# EAGLE design Hex-pendant-apa102-v1a (EAGLE 8.6.0)
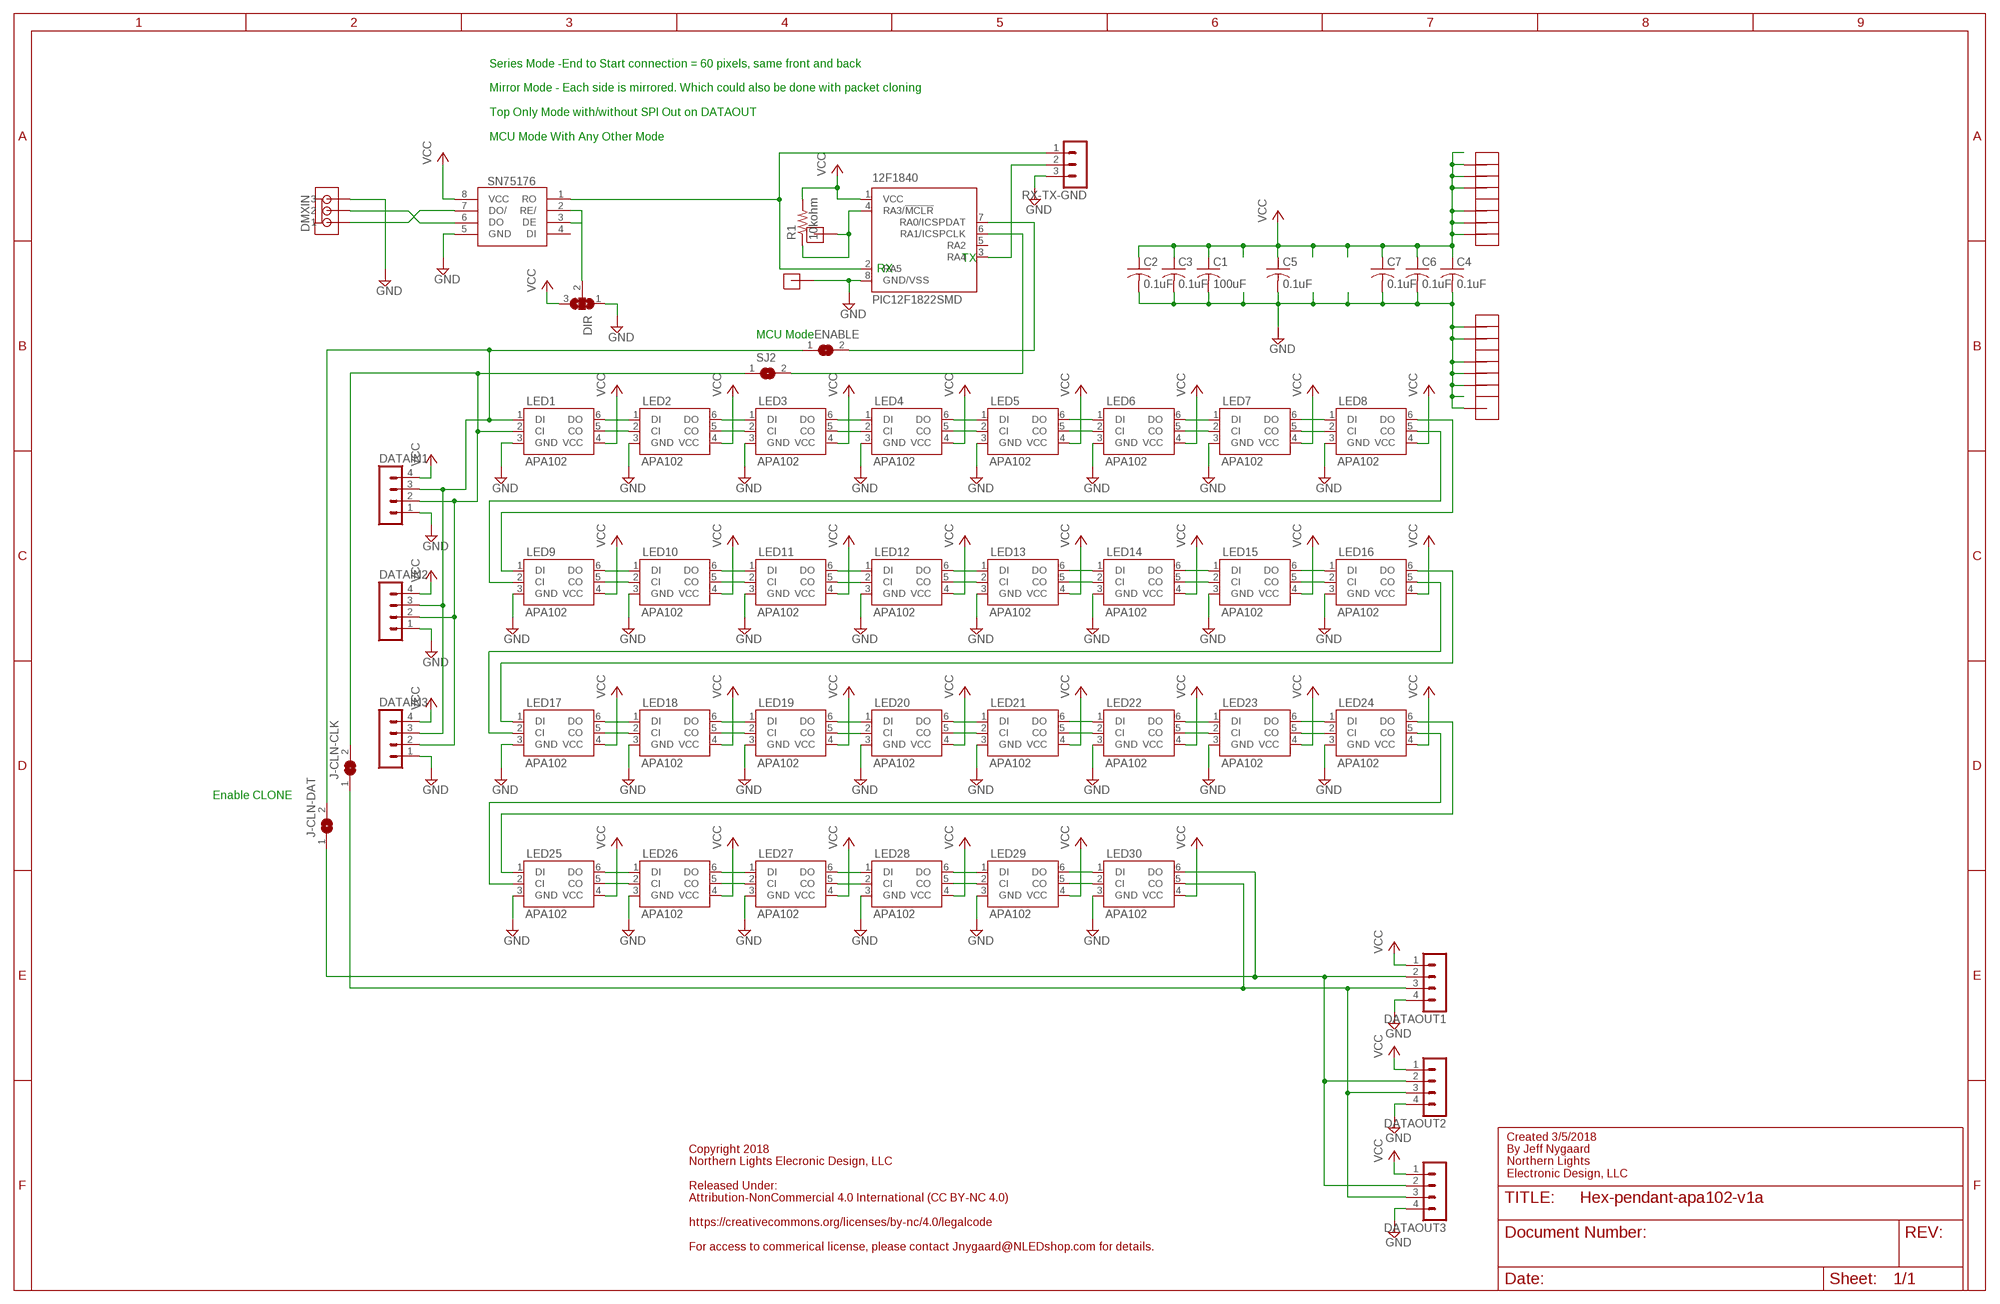
[diagram p0: schematic, sheet 1]

## Parts
12F1840  PIC12F1822SMD  [SO-08]
BUTTGND  JUMPER  [JUMPER]
BUTTON  JUMPER  [JUMPER]
C1  100uF  C-USC1206  [C1206]
C2  0.1uF  C-USC1206  [C1206]
C3  0.1uF  C-USC1206  [C1206]
C4  0.1uF  C-USC1206  [C1206]
C5  0.1uF  C-USC1206  [C1206]
C6  0.1uF  C-USC1206  [C1206]
C7  0.1uF  C-USC1206  [C1206]
DATAIN1  MA04-1  [MA04-1]
DATAIN2  MA04-1  [MA04-1]
DATAIN3  MA04-1  [MA04-1]
DATAOUT1  MA04-1  [MA04-1]
DATAOUT2  MA04-1  [MA04-1]
DATAOUT3  MA04-1  [MA04-1]
DIR  SJ2W  [SJ_2]
DMXIN  MOLEXKK3  [MOLEXKK3]
ENABLE  SJ  [SJ]
J-CLN-CLK  SJ  [SJ]
J-CLN-DAT  SJ  [SJ]
JGND1  1HEADER  [J1]
JGND3  1HEADER  [J1]
JGND4  1HEADER  [J1]
JGND5  1HEADER  [J1]
JGND6  1HEADER  [J1]
JGND7  1HEADER  [J1]
JVCC1  1HEADER  [J1]
JVCC2  1HEADER  [J1]
JVCC3  1HEADER  [J1]
JVCC4  1HEADER  [J1]
JVCC5  1HEADER  [J1]
JVCC6  1HEADER  [J1]
LED1  APA102  [APA102]
LED2  APA102  [APA102]
LED3  APA102  [APA102]
LED4  APA102  [APA102]
LED5  APA102  [APA102]
LED6  APA102  [APA102]
LED7  APA102  [APA102]
LED8  APA102  [APA102]
LED9  APA102  [APA102]
LED10  APA102  [APA102]
LED11  APA102  [APA102]
LED12  APA102  [APA102]
LED13  APA102  [APA102]
LED14  APA102  [APA102]
LED15  APA102  [APA102]
LED16  APA102  [APA102]
LED17  APA102  [APA102]
LED18  APA102  [APA102]
LED19  APA102  [APA102]
LED20  APA102  [APA102]
LED21  APA102  [APA102]
LED22  APA102  [APA102]
LED23  APA102  [APA102]
LED24  APA102  [APA102]
LED25  APA102  [APA102]
LED26  APA102  [APA102]
LED27  APA102  [APA102]
LED28  APA102  [APA102]
LED29  APA102  [APA102]
LED30  APA102  [APA102]
R1  10kohm  R-US_R1206  [R1206]
RX-TX-GND  MA03-12  [MA03-1-V2]
SJ2  SJ  [SJ]
TRANSCEIVER  SN75176SMD  [SOIC-8]

## Nets
GND: 12F1840.8(GND/VSS) BUTTGND.2(J1) C1.2 C2.2 C3.2 C4.2 C5.2 C6.2 C7.2 DATAIN1.1 DATAIN2.1 DATAIN3.1 DATAOUT1.4 DATAOUT2.4 DATAOUT3.4 DIR.1 DMXIN.3 JGND1.2(J1) JGND3.2(J1) JGND4.2(J1) JGND6.2(J1) JGND7.2(J1) JVCC4.2(J1) LED1.3(GND) LED2.3(GND) LED3.3(GND) LED4.3(GND) LED5.3(GND) LED6.3(GND) LED7.3(GND) LED8.3(GND) LED9.3(GND) LED10.3(GND) LED11.3(GND) LED12.3(GND) LED13.3(GND) LED14.3(GND) LED15.3(GND) LED16.3(GND) LED17.3(GND) LED18.3(GND) LED19.3(GND) LED20.3(GND) LED21.3(GND) LED22.3(GND) LED23.3(GND) LED24.3(GND) LED25.3(GND) LED26.3(GND) LED27.3(GND) LED28.3(GND) LED29.3(GND) LED30.3(GND) RX-TX-GND.3 TRANSCEIVER.5(GND)
N$1: LED1.6(DO) LED2.1(DI)
N$2: LED2.6(DO) LED3.1(DI)
N$3: LED3.6(DO) LED4.1(DI)
N$4: LED3.5(CO) LED4.2(CI)
N$5: LED2.5(CO) LED3.2(CI)
N$6: LED1.5(CO) LED2.2(CI)
N$7: LED4.6(DO) LED5.1(DI)
N$8: LED4.5(CO) LED5.2(CI)
N$9: LED5.6(DO) LED6.1(DI)
N$10: LED5.5(CO) LED6.2(CI)
N$11: LED8.5(CO) LED9.2(CI)
N$12: LED8.6(DO) LED9.1(DI)
N$13: LED7.6(DO) LED8.1(DI)
N$14: LED7.5(CO) LED8.2(CI)
N$15: LED6.5(CO) LED7.2(CI)
N$16: LED6.6(DO) LED7.1(DI)
N$17: LED17.6(DO) LED18.1(DI)
N$18: LED18.6(DO) LED19.1(DI)
N$19: LED19.6(DO) LED20.1(DI)
N$20: LED19.5(CO) LED20.2(CI)
N$21: LED18.5(CO) LED19.2(CI)
N$22: LED9.6(DO) LED10.1(DI)
N$23: LED10.6(DO) LED11.1(DI)
N$24: LED11.6(DO) LED12.1(DI)
N$25: LED11.5(CO) LED12.2(CI)
N$26: LED10.5(CO) LED11.2(CI)
N$27: LED9.5(CO) LED10.2(CI)
N$28: LED12.6(DO) LED13.1(DI)
N$29: LED12.5(CO) LED13.2(CI)
N$30: LED13.6(DO) LED14.1(DI)
N$31: LED13.5(CO) LED14.2(CI)
N$32: LED14.6(DO) LED15.1(DI)
N$33: LED14.5(CO) LED15.2(CI)
N$34: LED15.6(DO) LED16.1(DI)
N$35: LED15.5(CO) LED16.2(CI)
N$36: LED17.5(CO) LED18.2(CI)
N$37: LED20.6(DO) LED21.1(DI)
N$38: LED20.5(CO) LED21.2(CI)
N$39: LED21.6(DO) LED22.1(DI)
N$40: LED21.5(CO) LED22.2(CI)
N$41: LED25.6(DO) LED26.1(DI)
N$42: LED26.6(DO) LED27.1(DI)
N$43: LED27.6(DO) LED28.1(DI)
N$44: LED27.5(CO) LED28.2(CI)
N$45: LED26.5(CO) LED27.2(CI)
N$46: LED25.5(CO) LED26.2(CI)
N$47: LED28.6(DO) LED29.1(DI)
N$48: LED28.5(CO) LED29.2(CI)
N$49: LED29.6(DO) LED30.1(DI)
N$50: LED29.5(CO) LED30.2(CI)
N$55: LED24.5(CO) LED25.2(CI)
N$56: LED24.6(DO) LED25.1(DI)
N$57: LED23.6(DO) LED24.1(DI)
N$58: LED23.5(CO) LED24.2(CI)
N$59: LED22.5(CO) LED23.2(CI)
N$60: LED22.6(DO) LED23.1(DI)
N$61: LED16.5(CO) LED17.2(CI)
N$62: LED16.6(DO) LED17.1(DI)
N$65: DATAIN1.3 DATAIN2.3 DATAIN3.3 ENABLE.1 J-CLN-DAT.2 LED1.1(DI)
N$66: DATAIN1.2 DATAIN2.2 DATAIN3.2 J-CLN-CLK.2 LED1.2(CI) SJ2.1
N$117: DATAOUT1.3 DATAOUT2.3 DATAOUT3.3 J-CLN-CLK.1 LED30.5(CO)
N$121: DATAOUT1.2 DATAOUT2.2 DATAOUT3.2 J-CLN-DAT.1 LED30.6(DO)
N$126: 12F1840.2(RA5) RX-TX-GND.1 TRANSCEIVER.1(RO)
N$127: DIR.2 TRANSCEIVER.2(RE/) TRANSCEIVER.3(DE)
N$128: 12F1840.4(RA3/!MCLR) BUTTON.2(J1) R1.1
N$129: DMXIN.2 TRANSCEIVER.6(DO)
N$130: 12F1840.3(RA4) RX-TX-GND.2
N$131: DMXIN.1 TRANSCEIVER.7(DO/)
N$132: 12F1840.7(RA0/ICSPDAT) ENABLE.2
N$133: 12F1840.6(RA1/ICSPCLK) SJ2.2
VCC: 12F1840.1(VCC) C1.1 C2.1 C3.1 C4.1 C5.1 C6.1 C7.1 DATAIN1.4 DATAIN2.4 DATAIN3.4 DATAOUT1.1 DATAOUT2.1 DATAOUT3.1 DIR.3 JGND5.2(J1) JVCC1.2(J1) JVCC2.2(J1) JVCC3.2(J1) JVCC5.2(J1) JVCC6.2(J1) LED1.4(VCC) LED2.4(VCC) LED3.4(VCC) LED4.4(VCC) LED5.4(VCC) LED6.4(VCC) LED7.4(VCC) LED8.4(VCC) LED9.4(VCC) LED10.4(VCC) LED11.4(VCC) LED12.4(VCC) LED13.4(VCC) LED14.4(VCC) LED15.4(VCC) LED16.4(VCC) LED17.4(VCC) LED18.4(VCC) LED19.4(VCC) LED20.4(VCC) LED21.4(VCC) LED22.4(VCC) LED23.4(VCC) LED24.4(VCC) LED25.4(VCC) LED26.4(VCC) LED27.4(VCC) LED28.4(VCC) LED29.4(VCC) LED30.4(VCC) R1.2 TRANSCEIVER.8(VCC)
Unconnected: 12F1840.5(RA2) TRANSCEIVER.4(DI)

## Notes on the sheet
- Series Mode -End to Start connection = 60 pixels, same front and back
  
  Mirror Mode - Each side is mirrored. Which could also be done with packet cloning
  
  Top Only Mode with/without SPI Out on DATAOUT
  
  MCU Mode With Any Other Mode
- TX
- RX
- MCU Mode
- Enable CLONE
- Created 3/5/2018
  By Jeff Nygaard
  Northern Lights
  Electronic Design, LLC
- Copyright 2018
  Northern Lights Elecronic Design, LLC
  
  Released Under:
  Attribution-NonCommercial 4.0 International (CC BY-NC 4.0)
  
  https://creativecommons.org/licenses/by-nc/4.0/legalcode
  
  For access to commerical license, please contact Jnygaard@NLEDshop.com for details.

## Library data of the parts
12F1840 = ChromationSystems-2:PIC12F1822: 8-Pin FLASH-Based 8-Bit CMOS Microcontroller Precision Internal 4 MHz oscillator factory calibrated to ±1% Low Power Features: Standby Current: - 1 nA @ 2.0V, typical Operating Current: - 8.5µA @ 32 kHz, 2.0V, typical - 100µA @ 1 MHz, 2.0V, typical Watchdog Timer Current: - 300 nA @ 2.0V, typical Timer1 oscillator current: - 4µA @ 32 kHz, 2.0V, typical Analog-to-Digital Converter module: - 10-bit resolution - Programmable 4-channel input - Voltage reference input Source: http://www.microchip.com .. 41190E.pdf; MF: MICROCHIP; MPN: PIC12F675-E/SN; OC_FARNELL: 9759026; OC_NEWARK: 92C4341
BUTTGND BUTTON = ChromationSystems-1:JUMPER
C1-C7 = rcl:C-US: CAPACITOR, American symbol
DATAIN1-DATAIN3 DATAOUT1-DATAOUT3 = ChromationSystems-2:MA04-1: PIN HEADER; OC_FARNELL: unknown; OC_NEWARK: unknown
DIR = jumper:SJ2W: SMD solder JUMPER
DMXIN = ChromationSystems-1:MOLEXKK3
ENABLE J-CLN-CLK J-CLN-DAT SJ2 = jumper:SJ: SMD solder JUMPER
JGND1 JGND3-JGND7 JVCC1-JVCC6 = ChromationSystems-1:1HEADER
LED1-LED30 = ChromationSystems-2:APA102
R1 = rcl:R-US_: RESISTOR, American symbol
RX-TX-GND = ChromationSystems-2:MA03-1: PIN HEADER
TRANSCEIVER = ChromationSystems-2:SN75176

## Board
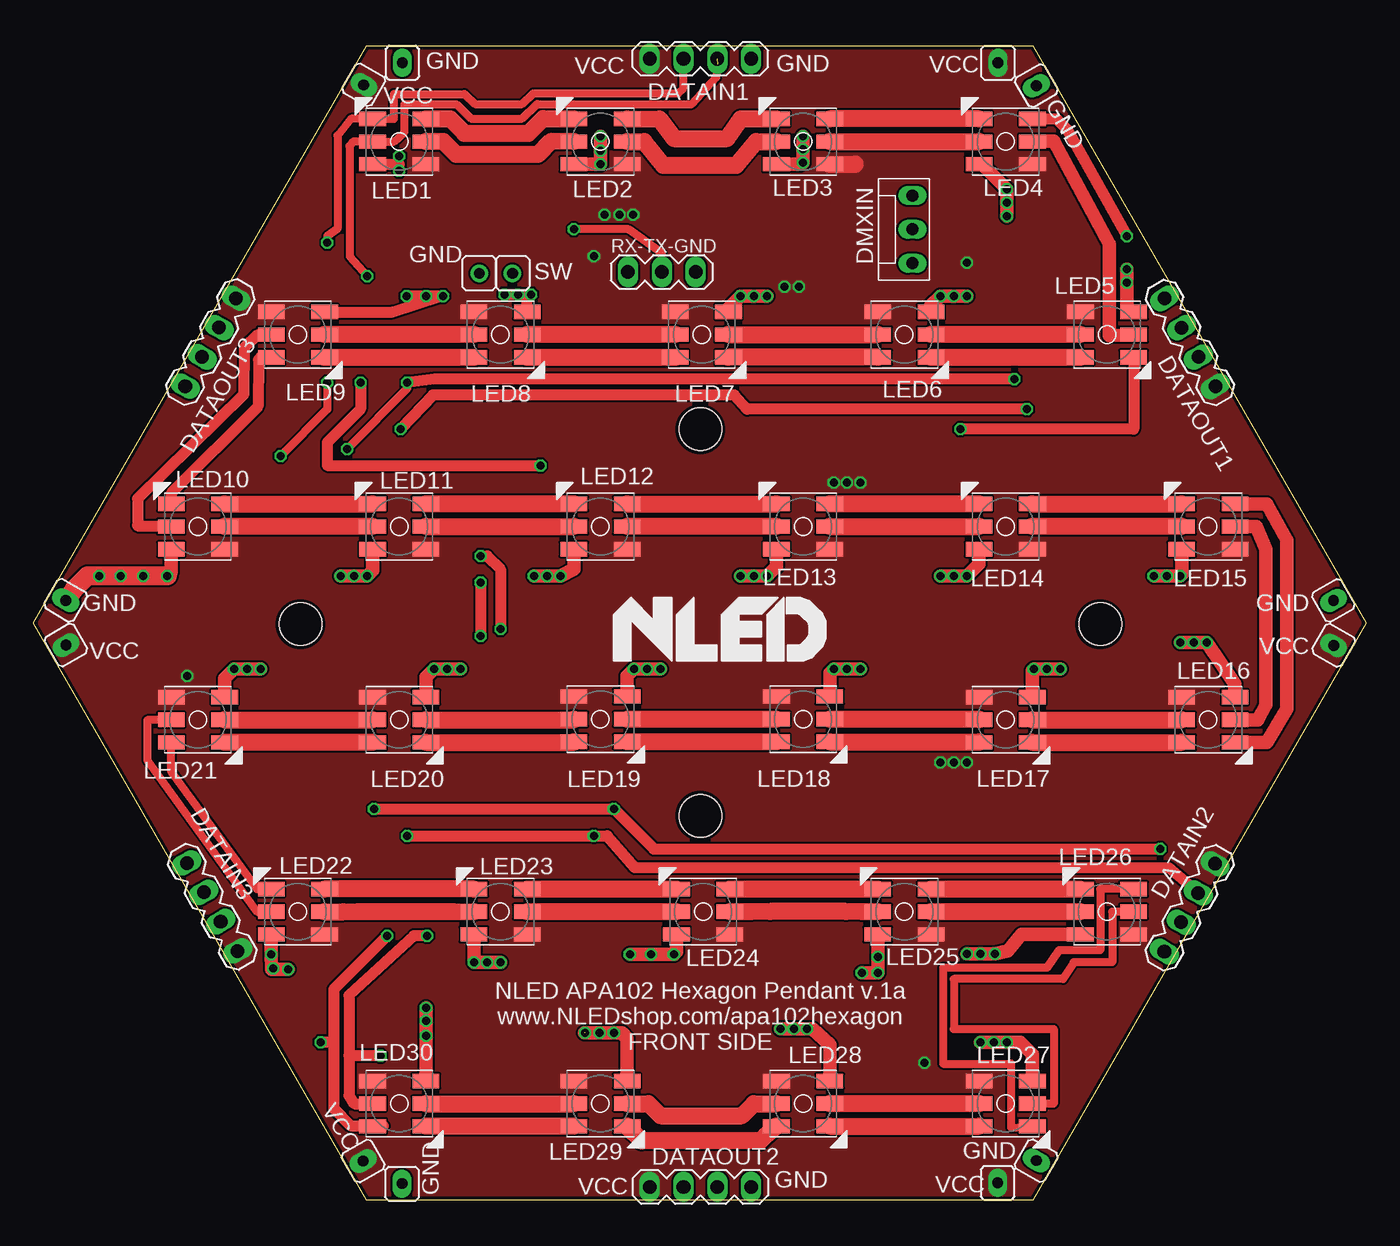
[diagram p1: board, top side]
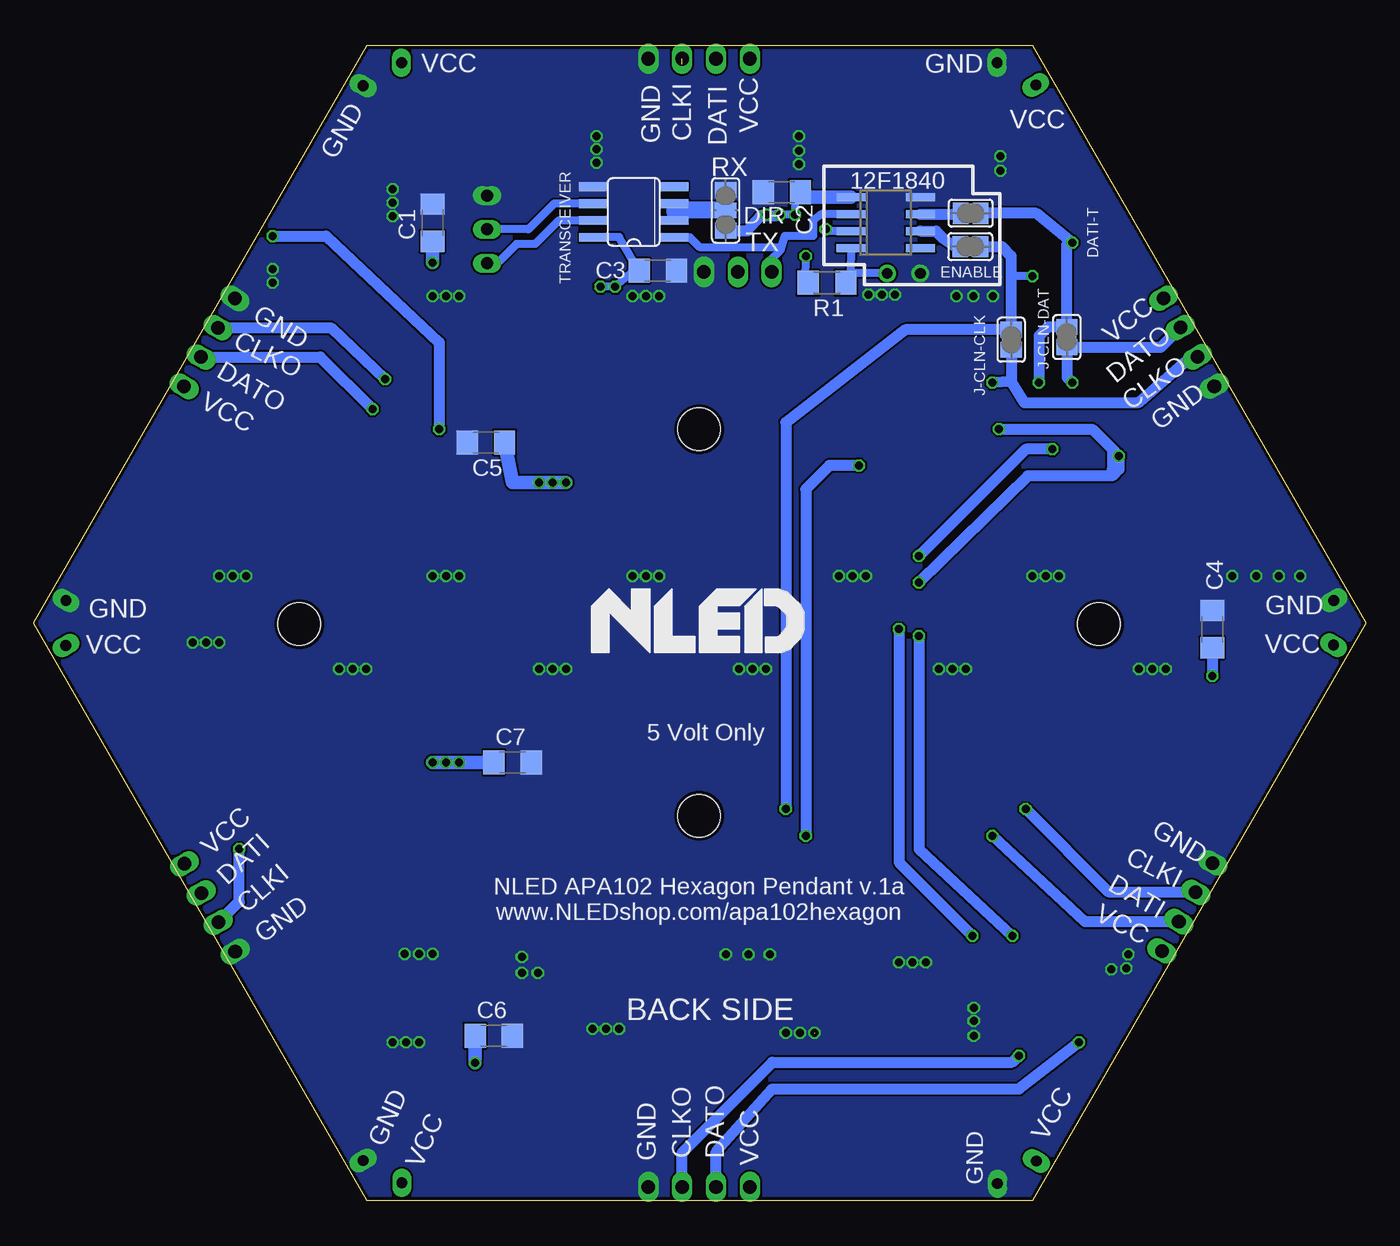
[diagram p2: board, bottom side, seen from below]

Size 100 x 86.6 mm. Coordinates in mm from the lower left corner, seen from the top.
Outline: 25,0 0,43.3 25,86.6 75,86.6 100,43.3 75,0 25,0
Copper layers (1*16): Top 0.035mm / dielectric 1.5mm / Bottom 0.035mm
Design rules "SeeedStudio_2layer_DRU_no_angle_20140221 *": minimum track width 6mil, minimum drill 12mil, track to track 6mil, track to pad 6mil, pad to pad 6mil, via to via 6mil, smd to smd 0mil, copper to edge 10mil, drill to drill 10mil, minimum pad ring 10mil, minimum via ring 6mil, stop-mask expansion 2mil, vias tented up to drill 100mil, thermal gap 10mil
Holes 3.2 mm at 50.05,57.84 20.05,43.22 80.05,43.22 50.05,28.84

### Footprints (pad centres in the part's own frame; a part is rotated, then mirrored left to right if it is on the bottom)
SO-08 = smd 0.6 x 2.2: 1 -1.905,-2.6; 2 -0.635,-2.6; 3 0.635,-2.6; 4 1.905,-2.6; 5 1.905,2.6; 6 0.635,2.6; 7 -0.635,2.6; 8 -1.905,2.6
JUMPER = drill 0.8: 2 0,0
C1206 = smd 1.6 x 1.8: 1 -1.4,0; 2 1.4,0
MA04-1 = drill 1.016 long: 1 -3.81,0; 2 -1.27,0; 3 1.27,0; 4 3.81,0
SJ_2 = smd 1.168 x 1.6: 1 -1.524,0; 2 0,0; 3 1.524,0
MOLEXKK3 = drill 0.9 long: 1 -2.54,0 | drill 0.9 pad 1.422 long: 2 0,0; 3 2.54,0
SJ = smd 1.168 x 1.6: 1 -0.762,0; 2 0.762,0
J1 = drill 0.813 pad 1.422 long: 2 0,0
APA102 = smd 2 x 1.067: 1 -2,1.7; 2 -2,0; 3 -2,-1.7; 4 2,-1.7; 5 2,0; 6 2,1.7
R1206 = smd 1.6 x 1.803: 1 -1.422,0; 2 1.422,0
MA03-1-V2 = drill 1.016 long: 1 -2.54,0; 2 0,0; 3 2.54,0
SOIC-8 = smd 0.66 x 2.032: 1 -1.905,-3.073; 2 -0.635,-3.073; 3 0.635,-3.073; 4 1.905,-3.073; 5 1.905,3.073; 6 0.635,3.073; 7 -0.635,3.073; 8 -1.905,3.073

### Placement (x,y rotation side)
12F1840  36.05,73.34 270 bottom
BUTTGND  33.45,69.54 0 top
BUTTON  35.95,69.54 0 top
C1  70.05,73.33 90 bottom
C2  43.85,75.64 180 bottom
C3  53.15,69.74 0 bottom
C4  11.55,42.84 90 bottom
C5  66.05,56.84 180 bottom
C6  65.45,12.34 0 bottom
C7  64.05,32.84 0 bottom
DATAIN1  50.05,85.64 180 top
DATAIN2  86.76,21.94 60 top
DATAIN3  13.42,21.99 300 top
DATAOUT1  86.78,64.36 120 top
DATAOUT2  50.05,0.99 0 top
DATAOUT3  13.3,64.37 240 top
DIR  48.06,74.26 270 bottom
DMXIN  65.95,72.84 90 top
ENABLE  29.68,74.04 180 bottom
J-CLN-CLK  26.63,64.55 90 bottom
J-CLN-DAT  22.46,64.75 90 bottom
JGND1  27.69,85.35 90 top
JGND3  75.25,2.97 330 top
JGND4  27.66,1.24 90 top
JGND5  24.75,2.93 30 top
JGND6  2.43,45 150 top
JGND7  97.55,44.98 30 top
JVCC1  97.56,41.62 150 top
JVCC2  24.79,83.67 150 top
JVCC3  2.45,41.64 30 top
JVCC4  75.26,83.61 30 top
JVCC5  72.35,1.29 90 top
JVCC6  72.38,85.33 90 top
LED1  27.45,79.42 0 top
LED2  42.55,79.42 0 top
LED3  57.75,79.42 0 top
LED4  72.95,79.42 0 top
LED5  80.55,64.94 180 top
LED6  65.35,64.94 180 top
LED7  50.15,64.94 180 top
LED8  35.05,64.94 180 top
LED9  19.85,64.94 180 top
LED10  12.35,50.54 0 top
LED11  27.45,50.54 0 top
LED12  42.55,50.54 0 top
LED13  57.75,50.54 0 top
LED14  72.95,50.54 0 top
LED15  88.15,50.54 0 top
LED16  88.15,36.04 180 top
LED17  72.95,36.04 180 top
LED18  57.75,36.09 180 top
LED19  42.55,36.09 180 top
LED20  27.45,36.04 180 top
LED21  12.35,36.04 180 top
LED22  19.85,21.64 0 top
LED23  35.05,21.64 0 top
LED24  50.25,21.64 0 top
LED25  65.35,21.64 0 top
LED26  80.55,21.64 0 top
LED27  72.95,7.24 180 top
LED28  57.75,7.24 180 top
LED29  42.55,7.24 180 top
LED30  27.45,7.24 180 top
R1  40.45,68.84 180 bottom
RX-TX-GND  47.15,69.64 0 top
SJ2  29.7,71.54 180 bottom
TRANSCEIVER  54.95,74.14 90 bottom

### Tracks (layer width: path | path; a pad name or v marks a point on that pad's centre or on a via)
GND  (via drill 0.6)  (1 unrouted)
  Top 0.61: v27.45,78.34 27.45,77.72 v27.45,77.24 | LED7.3 52.15,66.94
  Top 0.813: LED9.3 26.97,66.64 30.5,67.78 v30.76,67.84 v28,67.84 | LED8.3 37.05,67.84 v37.35,67.94 v35.35,67.94 | LED1.3 27.45,77.72
  Top 1.016: LED30.3 v29.45,14.44 | LED29.3 44.55,12.14 44.15,12.54 41.37,12.54 | LED28.3 59.75,11.64 58.45,12.84 v56.05,12.84 | LED22.3 v17.85,18.43 v17.86,18.43 17.89,17.3 v19.13,17.33 | LED2.3 42.53,77.72 v42.55,77.74 v42.55,78.74 v42.55,79.84 | LED3.3 57.53,77.72 v57.75,77.84 v57.75,78.84 v57.75,79.84 | LED4.3 71.17,77.72 v73.05,75.84 v73.05,74.84 v73.05,73.84 | LED6.3 67.35,67.14 v68.05,67.84 v69.05,67.84 v70.05,67.84 | LED11.3 25.45,47.24 v25.05,46.84 v24.05,46.84 v23.05,46.84 | LED10.3 10.35,47.14 v10.05,46.84 | LED12.3 40.55,47.34 v39.55,46.84 v38.55,46.84 v37.55,46.84 | LED13.3 55.75,47.54 v55.05,46.84 v54.05,46.84 v53.05,46.84 | LED14.3 70.95,47.74 v70.05,46.84 v69.05,46.84 v68.05,46.84 | LED15.3 86.15,46.94 v86.05,46.84 v85.05,46.84 v84.05,46.84 | LED20.3 29.45,39.24 v30.05,39.84 v31.05,39.84 v32.05,39.84 | LED19.3 44.55,39.34 v45.05,39.84 v46.05,39.84 v47.05,39.84 | LED18.3 59.75,39.54 v60.05,39.84 v61.05,39.84 v62.05,39.84 | LED17.3 74.95,39.74 v75.05,39.84 v76.05,39.84 v77.05,39.84 | LED16.3 90.15,38.74 v88.05,41.84 v87.05,41.84 v86.05,41.84 | LED23.3 v33.05,17.84 v34.05,17.84 v35.05,17.84 | LED24.3 48.25,18.64 v48.05,18.44 v46.35,18.44 v44.75,18.44 | LED25.3 v63.35,18.24 v63.35,17.04 v62.15,17.04 | LED26.3 74.15,19.94 73.1,18.69 v72.15,18.49 v71.05,18.49 v70.05,18.49 | LED27.3 74.95,10.94 74.05,11.84 v73.05,11.84 v72.05,11.84 v71.05,11.84 | LED21.3 14.35,39.14 v15.05,39.84 v16.05,39.84 v17.05,39.84 | 52.15,66.94 v53.05,67.84 v54.05,67.84 v55.05,67.84 | LED5.3 82.05,66.64 v82.05,69.84
  Top 1.422: v10.05,46.84 v8.25,46.84 v6.55,46.84 4.05,46.84 3.05,45.84 JGND6.2
  other vias: 29.45,13.44 29.45,12.34 43.55,12.54 57.05,12.84 58.05,12.84 36.35,67.94 29.46,67.84 18,17.4 82.05,68.84 4.95,46.84 42.48,12.54 41.39,12.55
  pour Bottom (no thermals): 25.05,-0.16 0.05,43.84 25.05,86.84 75.05,86.84 100.05,43.84 75.05,-0.16
N$1
  Top 1.27: LED1.6 31.27,81.12 32.35,80.04 37.15,80.04 38.25,81.14 LED2.1
N$2
  Top 1.27: LED2.6 46.98,81.11 48.05,79.64 52.05,79.64 53.09,81.12 LED3.1
N$3
  Top 1.27: LED4.1 LED3.6
N$4
  Top 1.27: LED3.5 LED4.2
N$5
  Top 1.27: LED2.5 45.83,79.42 47.25,77.64 52.75,77.64 54.23,79.42 LED3.2
N$6
  Top 1.27: LED2.2 38.85,79.44 37.85,78.44 31.75,78.44 30.77,79.42 LED1.5
N$7  (via drill 0.6)
  Top 0.813: LED4.6 76.77,81.12 77.55,80.34 v82.05,72.34 | LED5.1 82.55,57.84 v69.55,57.84
  Bottom 0.813: v82.05,72.34 78.05,72.34 69.55,64.34 v69.55,57.84
N$8
  Top 1.016: LED4.5 74.97,79.44 76.55,79.44 80.73,71.74 80.73,64.87 LED5.2
N$9
  Top 1.27: LED6.1 LED5.6
N$10
  Top 1.27: LED5.5 LED6.2
N$11
  Top 1.27: LED8.5 LED9.2
N$12
  Top 1.27: LED9.1 LED8.6
N$13
  Top 1.27: LED8.1 LED7.6
N$14
  Top 1.27: LED7.5 LED8.2
N$15
  Top 1.27: LED7.2 LED6.5
N$16
  Top 1.27: LED6.6 LED7.1
N$17
  Top 1.27: LED18.1 70.95,34.39 LED17.6
N$18
  Top 1.27: LED18.6 LED19.1
N$19
  Top 1.27: LED20.1 40.55,34.34 LED19.6
N$20
  Top 1.27: LED20.2 40.55,36.04 LED19.5
N$21
  Top 1.27: LED19.2 LED18.5
N$22
  Top 0.813: LED9.6 17.05,63.24 16.9,63.03 16.85,59.54 10.35,53.04 LED10.1
N$23
  Top 1.27: LED10.6 LED11.1
N$24
  Top 1.27: LED12.1 LED11.6
N$25
  Top 1.27: LED11.5 LED12.2
N$26
  Top 1.27: LED11.2 LED10.5
N$27
  Top 0.813: LED10.2 7.91,50.54 7.82,50.63 7.82,52.63 15.79,60.44 15.82,63.96 16.84,64.93 LED9.5
N$28
  Top 1.27: LED12.6 LED13.1
N$29
  Top 1.27: LED13.2 LED12.5
N$30
  Top 1.27: LED14.1 LED13.6
N$31
  Top 1.27: LED13.5 LED14.2
N$32
  Top 1.27: LED14.6 LED15.1
N$33
  Top 1.27: LED15.2 LED14.5
N$34
  Top 1.016: LED16.1 92.55,34.34 94.05,36.84 94.05,49.54 92.55,52.24 LED15.6
N$35
  Top 1.016: LED15.5 91.75,50.54 92.45,48.84 92.45,37.14 91.85,36.04 LED16.2
N$36
  Top 1.27: LED18.2 70.95,36.09 LED17.5
N$37
  Top 1.27: LED20.6 LED21.1
N$38
  Top 1.27: LED21.2 LED20.5
N$39
  Top 0.61: LED22.1 16.78,23.34 10.35,32.15 LED21.6
N$40
  Top 0.61: LED21.5 8.56,36.01 8.56,33.01 16.8,21.63 LED22.2
N$41
  Top 1.27: LED25.6 LED26.1
N$42
  Top 0.61: LED26.6 80.05,23.34 80.05,18.74 76.95,18.74 76.05,17.44 68.25,17.44 68.25,10.24 73.35,10.24 73.35,5.44 LED27.1
N$43
  Top 1.27: LED28.1 LED27.6
N$44
  Top 1.27: LED27.5 LED28.2
N$45
  Top 0.61: LED26.5 80.95,21.64 80.95,17.84 78.05,17.84 77.25,16.59 69.05,16.59 69.05,12.84 76.55,12.84 76.55,7.24 LED27.2
N$46
  Top 1.27: LED26.2 LED25.5
N$47
  Top 1.27: LED28.6 54.85,4.74 54.55,4.44 45.65,4.44 LED29.1
N$48
  Top 1.27: LED29.2 46.15,7.24 47.05,6.34 53.15,6.34 54.05,7.24 LED28.5
N$49
  Top 1.27: LED29.6 LED30.1
N$50
  Top 1.27: LED30.2 LED29.5
N$55
  Top 1.27: LED25.2 62.15,21.64 60.97,21.65 55.27,21.65 53.85,21.64 LED24.5
N$56
  Top 1.27: LED24.6 53.25,23.34 54.42,23.35 61.72,23.35 62.55,23.34 LED25.1
N$57
  Top 1.27: LED23.6 LED24.1
N$58
  Top 1.27: LED24.2 LED23.5
N$59
  Top 1.27: LED22.5 23.25,21.64 24.35,21.65 31.55,21.65 LED23.2
N$60
  Top 1.27: LED23.1 LED22.6
N$61
  Top 1.27: LED17.2 LED16.5
N$62
  Top 1.27: LED17.1 LED16.6
N$65  (via drill 0.6)
  Top 0.61: DATAIN1.3 48.78,83.44 48.38,83.04 37.52,83.04 36.65,82.24 33.15,82.24 32.35,82.99 27.05,82.99 27.05,81.12 LED1.1 23.83,81.12 22.83,79.87 22.83,72.87 22.05,72.34 v22.05,71.84
  Top 0.813: v28.05,27.34 v42.05,27.34 43.05,27.34 45.12,24.95 85.17,24.95 DATAIN2.3 | v24.55,61.34 24.55,59.34 22.05,56.84 22.05,55.12 v38.05,55.12
  Bottom 0.813: ENABLE.1 24.75,74.04 v22.05,71.84 22.46,71.74 J-CLN-DAT.2 23.87,65.52 24.55,64.84 v24.55,61.34 | DATAIN3.3 21.1,20.89 v28.05,27.34 | v38.05,55.12 40.27,55.12 42.05,53.34 v42.05,27.34
N$66  (via drill 0.6)  (1 unrouted)
  Top 0.61: 51.35,85.21 51.25,84.24 49.41,82.24 37.81,82.24 36.65,81.14 32.85,81.14 31.75,82.21 27.85,82.21 27.85,80.14 27.05,79.42 LED1.2 23.97,79.41 23.73,79.08 23.74,70.79 v25.05,69.34
  Top 0.813: v25.55,29.34 v43.55,29.34 46.55,26.34 v84.55,26.34
  Bottom 0.61: v25.05,69.34 26.65,69.34
  Bottom 0.813: SJ2.1 27.35,71.54 26.65,70.84 26.65,69.34 26.65,65.33 J-CLN-CLK.2 34.58,65.31 43.55,58.34 v43.55,29.34 | DATAIN3.2 19.3,23.09 v25.55,29.34 | 86.05,20.84 DATAIN2.2 84.63,22.34 84.55,22.34 v84.55,26.34
N$117  (via drill 0.6)
  Top 0.61: v28.05,61.34 28.06,60.9 v23.55,56.34
  Top 0.813: v73.61,61.61 30.11,61.61 v28.05,61.34 | v33.55,48.34 34.05,48.34 35.05,47.34 v35.05,42.84 | v29.55,19.84 28.55,19.84 23.69,15.35 23.69,10.84 | 23.69,10.84 23.69,7.85 24.07,7.23 24.87,7.23 LED30.5 | v26.05,10.84 23.69,10.84
  Bottom 0.813: 26.63,61.42 25.64,59.83 17.09,59.84 17.03,59.87 13.13,63.27 DATAOUT3.3 | J-CLN-CLK.1 26.63,61.42 | 26.63,61.42 v28.05,61.34 | DATAOUT1.3 77.67,65.46 v73.61,61.61 | v23.55,56.34 25.55,56.34 v33.55,48.34 | v35.05,42.84 35.05,25.34 v29.55,19.84 | DATAOUT2.3 51.32,3.57 44.55,10.34 26.55,10.34 v26.05,10.84
N$121  (via drill 0.6)
  Top 0.61: v22.05,61.34 22.05,59.34 v18.55,55.84
  Top 0.813: v74.55,59.34 53.55,59.34 52.6,60.41 29.99,60.41 v27.55,57.84 | v33.55,46.34 v33.55,42.34 | v26.55,19.84 22.55,15.84 22.55,11.84 | 26.25,5.54 LED30.6 23.85,5.54 22.55,6.84 22.55,11.84 | 22.55,11.84 v21.55,11.84
  Bottom 0.813: DATAOUT3.2 15.41,63.99 J-CLN-DAT.1 22.46,61.74 v22.05,61.34 | DATAOUT1.2 78.47,63.26 v74.55,59.34 | v27.55,57.84 20.55,57.84 19.05,56.34 | 19.05,56.34 v18.55,55.84 18.55,54.84 19.05,54.34 25.39,54.34 v33.55,46.34 | v33.55,42.34 33.55,26.34 v26.55,19.84 | DATAOUT2.2 48.78,3.61 44.55,8.34 26.05,8.34 v21.55,11.84 | 19.05,56.34 19.05,54.84
N$126
  Bottom 0.61: 12F1840.2 40.91,73.97 41.5,73.54 41.5,72.34 43.63,72.34 | 43.63,72.34 43.91,71.48 49.97,71.48 50.72,72.23 TRANSCEIVER.1 | 43.63,72.34 43.99,71.21 44.65,70.55 44.65,69.28 RX-TX-GND.1
N$127
  Bottom 0.61: TRANSCEIVER.2 51.88,74.19 TRANSCEIVER.3
  Bottom 1.27: DIR.2 51.88,74.26 51.88,74.19
N$128
  Bottom 0.61: R1.1 38.65,68.84 38.65,68.94 38.64,69.53 | 38.64,69.53 38.63,71.41 12F1840.4 | BUTTON.2 38.64,69.53
N$129
  Bottom 0.61: TRANSCEIVER.6 60.91,74.77 62.85,72.84 DMXIN.2
N$130  (via drill 0.6)
  Top 0.61: RX-TX-GND.2 47.15,71.04 44.65,72.84 v40.55,72.84
  Bottom 0.61: 12F1840.3 40.21,72.7 v40.55,72.84
N$131
  Bottom 0.61: TRANSCEIVER.7 60.58,73.5 62.35,71.74 63.75,71.74 65.15,70.34 66.01,70.34 DMXIN.1
N$132
  Bottom 0.813: 12F1840.7 30.31,73.97 ENABLE.2
N$133
  Bottom 0.813: 12F1840.6 32.27,72.7 31.8,72.23 30.91,71.59 SJ2.2
VCC  (via drill 0.6)
  Top 1.27: LED3.4 61.65,77.72 61.65,77.74
  Bottom 0.61: R1.2 42.07,68.96 v42.05,70.84 | TRANSCEIVER.8 56.05,72.26 C3.1 54.95,69.74 v56.35,68.54 v57.45,68.54 | 42.55,75.24 42.8,75.19 v42.85,73.94 v44,73.94
  Bottom 0.813: DIR.3 46.4,72.74 45.39,73.88 44.25,73.88 v44,73.94 | C4.1 v11.55,39.34
  Bottom 1.016: v60.05,53.84 v61.05,53.84 v62.05,53.84 64.05,53.84 C5.1 | v70.05,32.84 v69.05,32.84 v68.05,32.84 C7.1 | 12F1840.1 40.65,75.24 42.55,75.24 C2.1 | C1.1 v70.05,70.33 | C6.1 v66.84,10.3
  other vias: 45.01,73.94
  pour Top (rank 6, no thermals): 25.05,-0.16 0.05,42.84 25.05,86.84 75.05,86.84 100.05,43.84 75.05,-0.16

### Text on the board
tNames: VCC | VCC | GND | GND | VCC | GND | GND | SW | GND | GND | VCC | VCC | NLED APA102 Hexagon Pendant v.1a / www.NLEDshop.com/apa102hexagon / FRONT SIDE | VCC | GND | VCC | GND | GND | VCC
bNames: GND | VCC | CLKI | GND | GND | VCC | VCC | DATI | RX | DATI-T | TX | GND | VCC | CLKO | DATO | DATO | CLKO | VCC | GND | GND | GND | VCC | VCC | 5 Volt Only | GND | VCC | CLKI | DATI | NLED APA102 Hexagon Pendant v.1a / www.NLEDshop.com/apa102hexagon | DATI | CLKI | VCC | GND | BACK SIDE | VCC | GND | VCC | GND | DATO | CLKO | GND | VCC